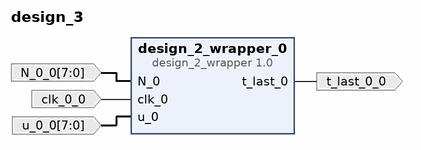
[diagram p0: block diagram of the top level]
# Vivado block design design_3, xczu7ev-ffvc1156-2-e, Vivado 2022.2
create_bd_design design_3

create_bd_port -dir I -from 7 -to 0 N_0_0
create_bd_port -dir I clk_0_0
create_bd_port -dir I -from 7 -to 0 u_0_0
create_bd_port -dir O t_last_0_0

create_bd_cell -type ip -vlnv xilinx.com:user:design_2_wrapper:1.0 design_2_wrapper_0

# ---- connections ----

connect_bd_net -net N_0_0_1 [get_bd_ports N_0_0] [get_bd_pins design_2_wrapper_0/N_0]
connect_bd_net -net clk_0_0_1 [get_bd_ports clk_0_0] [get_bd_pins design_2_wrapper_0/clk_0]
connect_bd_net [get_bd_pins design_2_wrapper_0/t_last_0] [get_bd_ports t_last_0_0]
connect_bd_net -net u_0_0_1 [get_bd_ports u_0_0] [get_bd_pins design_2_wrapper_0/u_0]

validate_bd_design
save_bd_design
